# EAGLE design Lab 3 PCB_schematic_redo (EAGLE 9.1.3)
DRAWING_AUTHOR: Cindy Tzapin
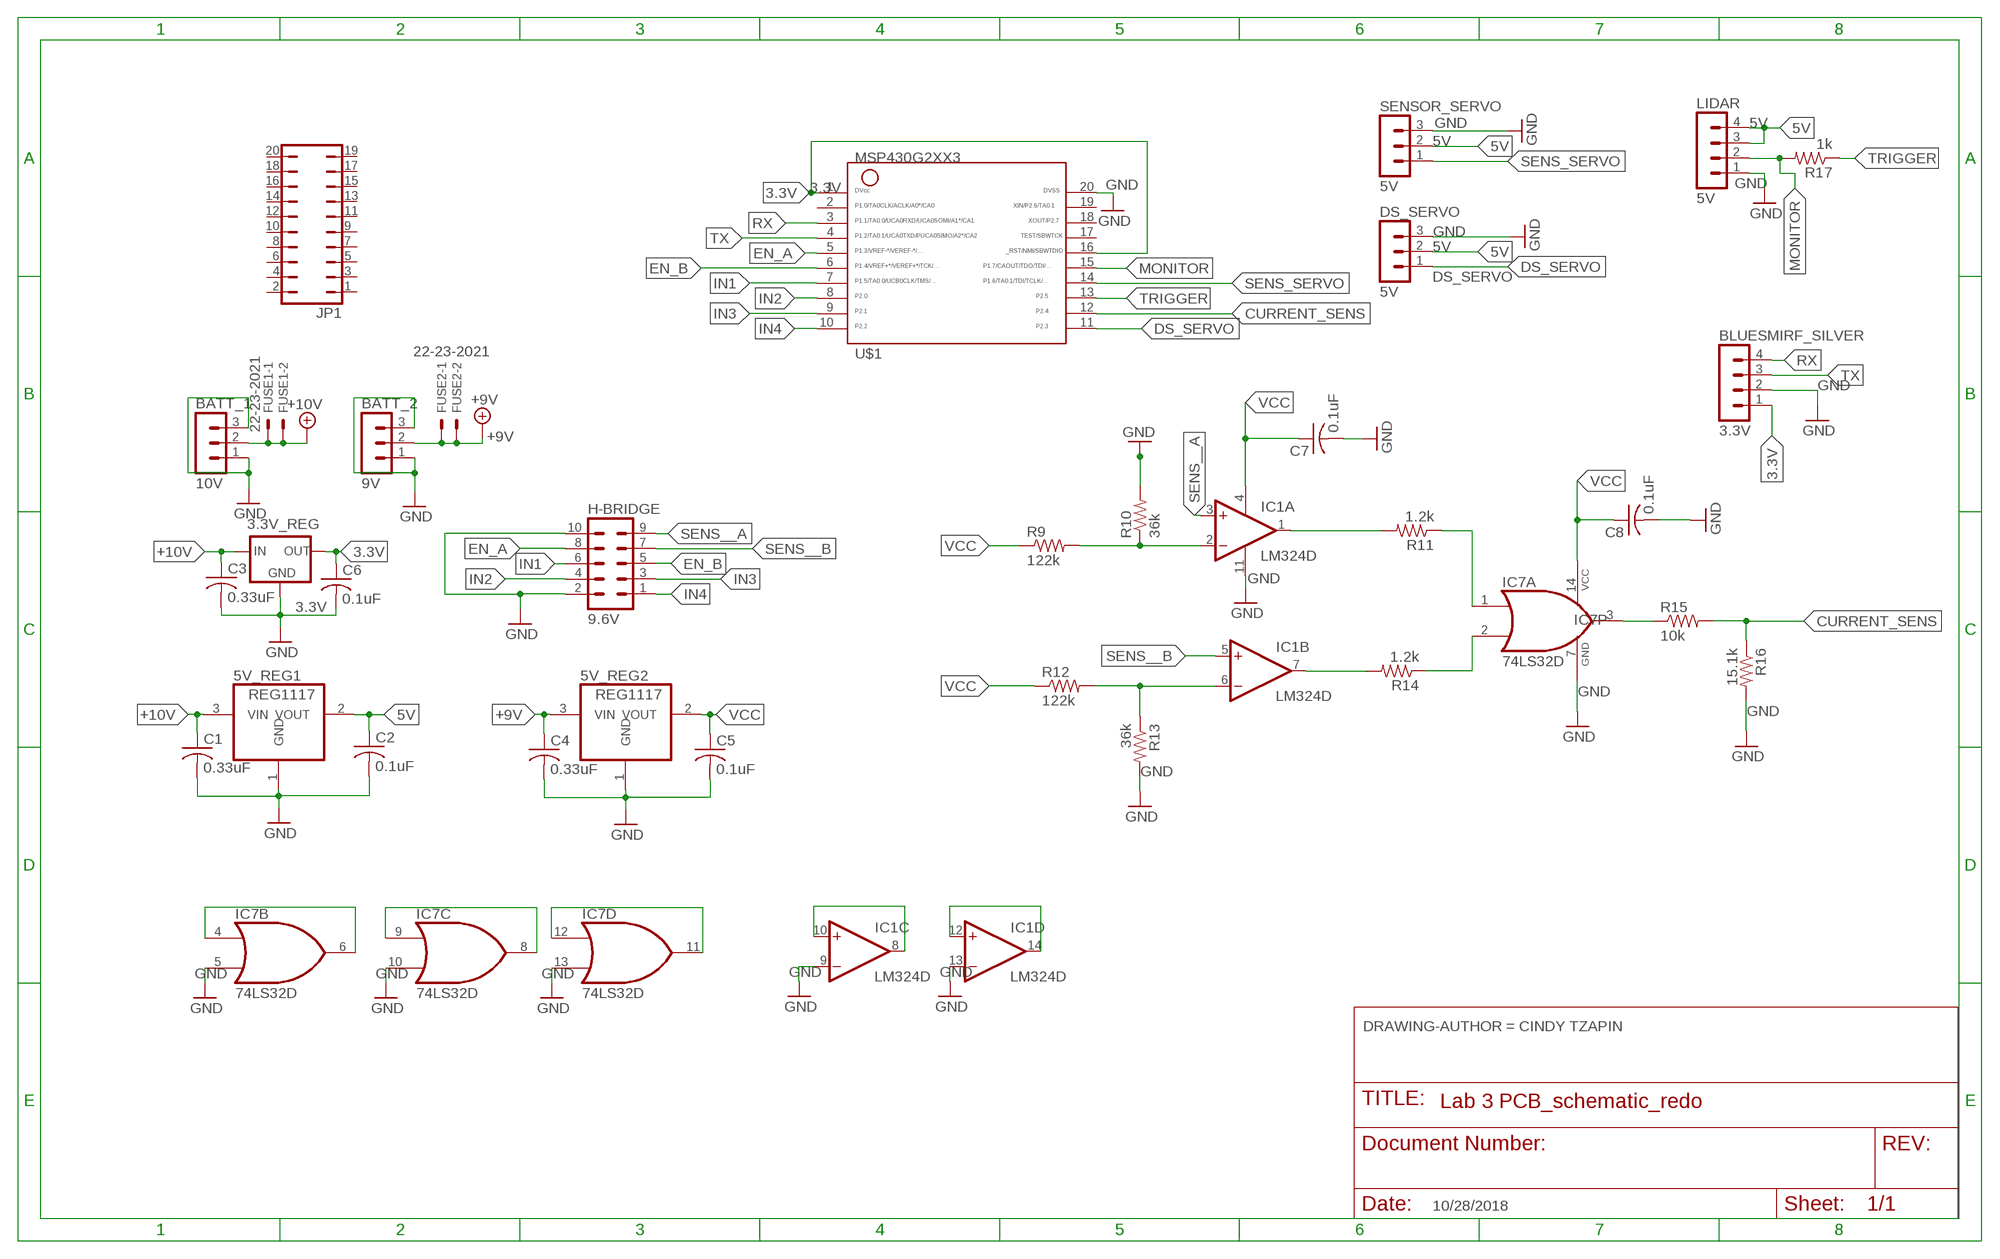
[diagram p0: schematic, sheet 1]
FRAME1 (DOCFIELD): DATE: 10/28/2018; DRAWING-AUTHOR: CINDY TZAPIN

## Parts
3.3V_REG  3.3V  78LXX  [78LXX]
5V_REG1  REG1117  [SOT223]
5V_REG2  REG1117  [SOT223]
BATT_1  10V  MA03-1  [MA03-1]
BATT_2  9V  MA03-1  [MA03-1]
BLUESMIRF_SILVER  3.3V  MA04-1  [MA04-1]
C1  0.33uF  C-US025-024X044  [C025-024X044]
C2  0.1uF  C-US025-024X044  [C025-024X044]
C3  0.33uF  C-US025-024X044  [C025-024X044]
C4  0.33uF  C-US025-024X044  [C025-024X044]
C5  0.1uF  C-US025-024X044  [C025-024X044]
C6  0.1uF  C-US025-024X044  [C025-024X044]
C7  0.1uF  C-US025-024X044  [C025-024X044]
C8  0.1uF  C-US025-024X044  [C025-024X044]
DS_SERVO  5V  MA03-1  [MA03-1]
FUSE1  22-23-2021  [22-23-2021]
FUSE2  22-23-2021  [22-23-2021]
H-BRIDGE  9.6V  MA05-2  [MA05-2]
IC1  LM324D  [SO14]
IC7  74LS32D  [SO14]
JP1  JP10Q  [JP10Q]
LIDAR  5V  MA04-1  [MA04-1]
R9  122k  R-US_R0805  [R0805]
R10  36k  R-US_R0805  [R0805]
R11  1.2k  R-US_R0805  [R0805]
R12  122k  R-US_R0805  [R0805]
R13  36k  R-US_R0805  [R0805]
R14  1.2k  R-US_R0805  [R0805]
R15  10k  R-US_R0805  [R0805]
R16  15.1k  R-US_R0805  [R0805]
R17  1k  R-US_R0805  [R0805]
SENSOR_SERVO  5V  MA03-1  [MA03-1]
U$1  G2XX3---N20  [N20]

## Nets
3.3V: 3.3V_REG.OUT BLUESMIRF_SILVER.1 C6.1 U$1.1 U$1.16
5V: 5V_REG1.2(VOUT) C2.1 DS_SERVO.2 LIDAR.3 LIDAR.4 SENSOR_SERVO.2
+9V: 5V_REG2.3(VIN) BATT_2.2 C4.1 FUSE2.1 FUSE2.2
+10V: 3.3V_REG.IN 5V_REG1.3(VIN) BATT_1.2 C1.1 C3.1 FUSE1.1 FUSE1.2
CURRENT_SENS: R15.2 R16.1 U$1.12
DS_SERVO: DS_SERVO.1 U$1.11
EN_A: H-BRIDGE.8 U$1.5
EN_B: H-BRIDGE.5 U$1.6
GND: 3.3V_REG.GND 5V_REG1.1(GND) 5V_REG2.1(GND) BATT_1.1 BATT_1.3 BATT_2.1 BATT_2.3 BLUESMIRF_SILVER.2 C1.2 C2.2 C3.2 C4.2 C5.2 C6.2 C7.2 C8.2 DS_SERVO.3 H-BRIDGE.2 H-BRIDGE.10 IC1.9(C:-IN) IC1.11(P:V-) IC1.13(D:-IN) IC7.5(B:I1) IC7.7(P:GND) IC7.10(C:I1) IC7.13(D:I1) LIDAR.1 R10.2 R13.2 R16.2 SENSOR_SERVO.3 U$1.20
IN1: H-BRIDGE.6 U$1.7
IN2: H-BRIDGE.4 U$1.8
IN3: H-BRIDGE.3 U$1.9
IN4: H-BRIDGE.1 U$1.10
MONITOR: LIDAR.2 R17.2 U$1.15
N$3: IC7.4(B:I0) IC7.6(B:O)
N$5: IC1.6(B:-IN) R12.2 R13.1
N$7: IC1.2(A:-IN) R9.2 R10.1
N$17: IC7.1(A:I0) R11.1
N$18: IC1.8(C:OUT) IC1.10(C:+IN)
N$19: IC1.1(A:OUT) R11.2
N$20: IC1.7(B:OUT) R14.2
N$21: IC7.2(A:I1) R14.1
N$22: IC7.3(A:O) R15.1
N$28: IC7.8(C:O) IC7.9(C:I0)
N$29: IC7.11(D:O) IC7.12(D:I0)
N$33: IC1.12(D:+IN) IC1.14(D:OUT)
RX: BLUESMIRF_SILVER.4 U$1.3
SENS__A: H-BRIDGE.9 IC1.3(A:+IN)
SENS__B: H-BRIDGE.7 IC1.5(B:+IN)
SENS_SERVO: SENSOR_SERVO.1 U$1.14
TRIGGER: R17.1 U$1.13
TX: BLUESMIRF_SILVER.3 U$1.4
VCC: 5V_REG2.2(VOUT) C5.1 C7.1 C8.1 IC1.4(P:V+) IC7.14(P:VCC) R9.1 R12.1
Unconnected: JP1.1 JP1.2 JP1.3 JP1.4 JP1.5 JP1.6 JP1.7 JP1.8 JP1.9 JP1.10 JP1.11 JP1.12 JP1.13 JP1.14 JP1.15 JP1.16 JP1.17 JP1.18 JP1.19 JP1.20 U$1.2 U$1.17 U$1.18 U$1.19

## Library data of the parts
3.3V_REG = v-reg:78LXX: VOLTAGE REGULATOR; OC_NEWARK: unknown
5V_REG1 5V_REG2 = burr-brown:REG1117: 800mA and 1A Low Dropout (LDO) Positive Regulator 1.8V, 2.5V, 2.85V, 3.3V, 5V, and Adj; OC_FARNELL: 1097566; OC_NEWARK: unknown; SPICEPREFIX: J
BATT_1 BATT_2 DS_SERVO SENSOR_SERVO = con-lstb:MA03-1: PIN HEADER; OC_FARNELL: unknown; OC_NEWARK: unknown
BLUESMIRF_SILVER LIDAR = con-lstb:MA04-1: PIN HEADER; OC_FARNELL: unknown; OC_NEWARK: unknown
C1-C8 = resistor:C-US: CAPACITOR, American symbol
FUSE1 FUSE2 = con-molex:22-23-2021: .100" (2.54mm) Center Header - 2 Pin; MF: MOLEX; MPN: 22-23-2021; OC_FARNELL: 1462926; OC_NEWARK: 25C3832
H-BRIDGE = con-lstb:MA05-2: PIN HEADER; OC_FARNELL: unknown; OC_NEWARK: unknown
IC1 = linear:LM324: OP AMP; OC_NEWARK: unknown
IC7 = 74xx-us:74*32: Quad 2-input OR gate; OC_NEWARK: unknown
JP1 = jumper:JP10Q: JUMPER
R9-R17 = rcl:R-US_: RESISTOR, American symbol; OC_NEWARK: unknown; SPICEPREFIX: R
U$1 = TI_MSP430_v16:G2XX3---N20: MSP430G2XX1 PDIP (N) 20 Pin Package; OC_NEWARK: unknown

## Net classes
0 default: width 0.559 mm, drill 0.508 mm, clearance 0.254 mm

## Board
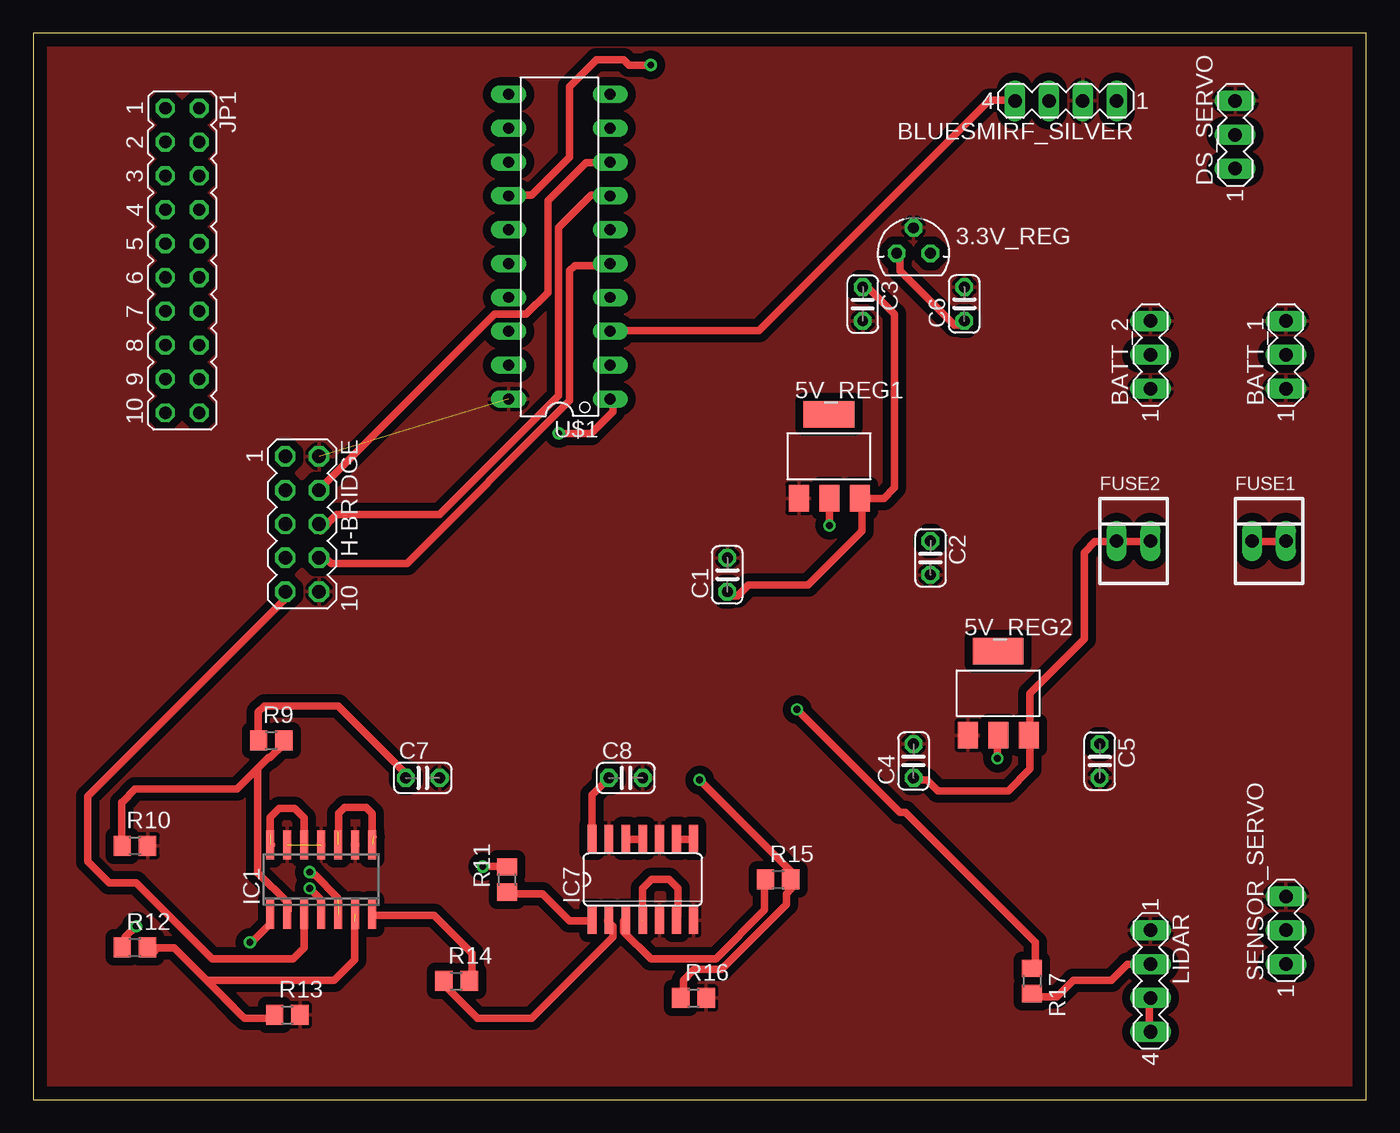
[diagram p1: board, top side]
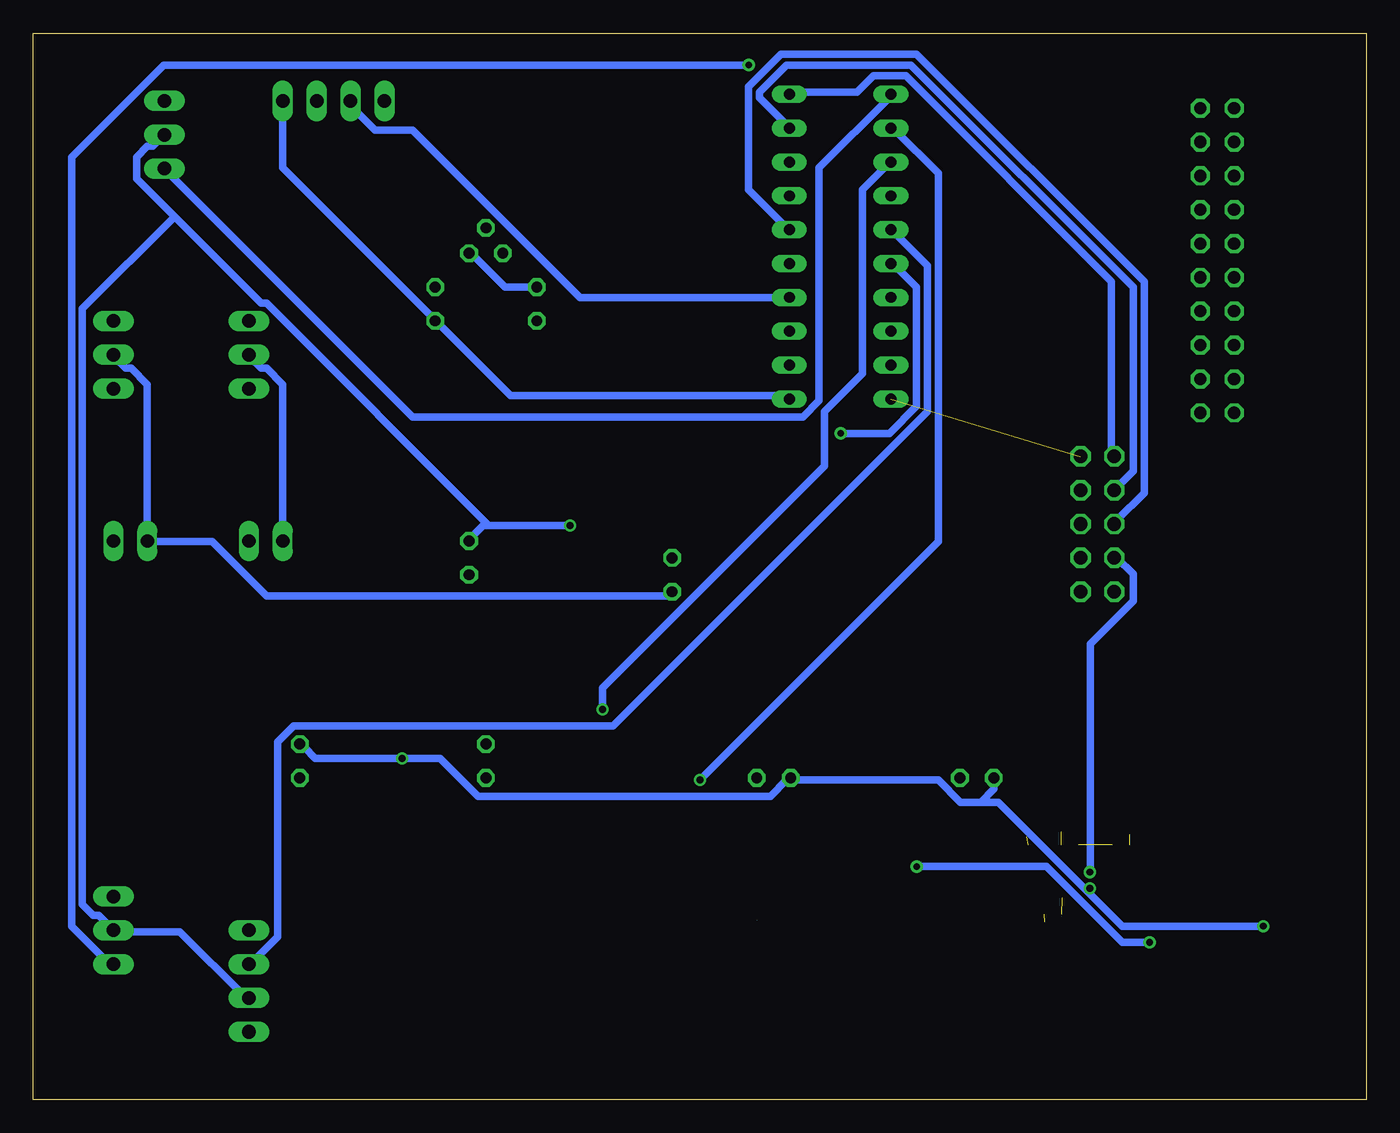
[diagram p2: board, bottom side, seen from below]

Size 100 x 80 mm. Coordinates in mm from the lower left corner, seen from the top.
Outline: 0,0 100,0 100,80 0,80 0,0
Copper layers (1*16): Top 0.035mm / dielectric 1.5mm / Bottom 0.035mm
Design rules "default *": minimum track width 10mil, minimum drill 0.35mm, track to track 10mil, track to pad 6mil, pad to pad 10mil, via to via 6mil, smd to smd 6mil, copper to edge 40mil, drill to drill 10mil, minimum pad ring 10mil, minimum via ring 8mil, stop-mask expansion 4mil, vias tented up to drill 0mil, thermal gap 10mil

### Footprints (pad centres in the part's own frame; a part is rotated, then mirrored left to right if it is on the bottom)
78LXX = drill 0.813 octagon: GND 0,1.905; IN 1.27,0; OUT -1.27,0
SOT223 = smd 1.499 x 2.007: 1 -2.261,-3.15; 2 0.025,-3.15; 3 2.311,-3.15 | smd 3.81 x 2.007: 4 0,3.15
MA03-1 = drill 1.016 long: 1 -2.54,0; 2 0,0; 3 2.54,0
MA04-1 = drill 1.016 long: 1 -3.81,0; 2 -1.27,0; 3 1.27,0; 4 3.81,0
C025-024X044 = drill 0.813 octagon: 1 -1.27,0; 2 1.27,0
22-23-2021 = drill 1 long: 1 -1.27,0; 2 1.27,0
MA05-2 = drill 1.016 octagon: 1 -5.08,-1.27; 2 -5.08,1.27; 3 -2.54,-1.27; 4 -2.54,1.27; 5 0,-1.27; 6 0,1.27; 7 2.54,-1.27; 8 2.54,1.27; 9 5.08,-1.27; 10 5.08,1.27
SO14 = smd 0.6 x 2.2: 1 -3.81,-2.6; 2 -2.54,-2.6; 3 -1.27,-2.6; 4 0,-2.6; 5 1.27,-2.6; 6 2.54,-2.6; 7 3.81,-2.6; 8 3.81,2.6; 9 2.54,2.6; 10 1.27,2.6; 11 0,2.6; 12 -1.27,2.6; 13 -2.54,2.6; 14 -3.81,2.6
SO14' = smd 0.66 x 2.032: 1 -3.81,-3.073; 2 -2.54,-3.073; 3 -1.27,-3.073; 4 0,-3.073; 5 1.27,-3.073; 6 2.54,-3.073; 7 3.81,-3.073; 8 3.81,3.073; 9 2.54,3.073; 10 1.27,3.073; 11 0,3.073; 12 -1.27,3.073; 13 -2.54,3.073; 14 -3.81,3.073
JP10Q = drill 0.914 octagon: 1 -11.43,-1.27; 2 -11.43,1.27; 3 -8.89,-1.27; 4 -8.89,1.27; 5 -6.35,-1.27; 6 -6.35,1.27; 7 -3.81,-1.27; 8 -3.81,1.27; 9 -1.27,-1.27; 10 -1.27,1.27; 11 1.27,-1.27; 12 1.27,1.27; 13 3.81,-1.27; 14 3.81,1.27; 15 6.35,-1.27; 16 6.35,1.27; 17 8.89,-1.27; 18 8.89,1.27; 19 11.43,-1.27; 20 11.43,1.27
R0805 = smd 1.3 x 1.5: 1 -0.95,0; 2 0.95,0
N20 = drill 0.813 long: 1 -11.435,-3.81; 2 -8.895,-3.81; 3 -6.355,-3.81; 4 -3.815,-3.81; 5 -1.275,-3.81; 6 1.265,-3.81; 7 3.805,-3.81; 8 6.345,-3.81; 9 8.885,-3.81; 10 11.425,-3.81; 11 11.425,3.81; 12 8.885,3.81; 13 6.345,3.81; 14 3.805,3.81; 15 1.265,3.81; 16 -1.275,3.81; 17 -3.815,3.81; 18 -6.355,3.81; 19 -8.895,3.81; 20 -11.435,3.81

### Placement (x,y rotation side)
3.3V_REG  66.04,63.5 0 top
5V_REG1  59.69,48.26 0 top
5V_REG2  72.39,30.48 0 top
BATT_1  93.98,55.88 90 top
BATT_2  83.82,55.88 90 top
BLUESMIRF_SILVER  77.47,74.93 180 top
C1  52.07,39.37 90 top
C2  67.31,40.64 270 top
C3  62.23,59.69 270 top
C4  66.04,25.4 90 top
C5  80.01,25.4 270 top
C6  69.85,59.69 90 top
C7  29.21,24.13 0 top
C8  44.45,24.13 0 top
DS_SERVO  90.17,72.39 90 top
FUSE1  92.71,41.91 0 top
FUSE2  82.55,41.91 0 top
H-BRIDGE  20.17,43.18 270 top
IC1  21.59,16.51 0 top
IC7  74LS32D  [SO14']  45.72,16.51 0 top
JP1  11.18,62.96 270 top
LIDAR  83.82,8.89 270 top
R9  17.86,26.95 0 top
R10  7.62,19.05 0 top
R11  35.56,16.51 90 top
R12  7.62,11.43 0 top
R13  19.05,6.35 0 top
R14  31.75,8.89 0 top
R15  55.88,16.51 0 top
R16  49.53,7.62 0 top
R17  74.93,8.89 270 top
SENSOR_SERVO  93.98,12.7 90 top
U$1  39.47,64 90 top

### Tracks (layer width: path | path; a pad name or v marks a point on that pad's centre or on a via)
3.3V  (via drill 0.51)
  Top 0.559: v39.42,49.99 41.86,49.99 43.48,51.61 43.48,52.43 U$1.1 | 3.3V_REG.OUT 65.02,63.4 65.02,62.18 69.09,58.12 69.49,58.12 C6.1
  Bottom 0.559: U$1.1 43.48,52.83 64.21,52.83 69.49,58.12 C6.1 69.9,58.52 81.28,69.9 BLUESMIRF_SILVER.1 | v39.42,49.99 35.76,49.99 33.73,52.02 33.73,60.96 35.36,62.59 U$1.16
5V  (via drill 0.51)
  Top 0.559: LIDAR.4 83.72,5.28 83.72,7.32 LIDAR.3 | v59.74,43.08 59.74,45.11 5V_REG1.2
  Bottom 0.559: LIDAR.3 84.12,7.72 89,12.6 93.88,12.6 SENSOR_SERVO.2 95.1,13.82 95.5,13.82 96.32,14.63 96.32,59.33 89.41,66.24 | 65.84,43.08 66.24,43.08 67.06,42.27 C2.1 | 65.84,43.08 v59.74,43.08 | DS_SERVO.2 91.03,71.53 91.44,71.53 92.25,70.71 92.25,69.09 89.41,66.24 | 89.41,66.24 82.91,59.74 82.5,59.74 65.84,43.08
+9V
  Top 0.559: C4.1 66.24,23.98 67.06,23.98 67.87,23.16 73.15,23.16 74.78,24.79 74.78,27.23 5V_REG2.3 74.78,27.64 74.78,30.48 78.84,34.54 78.84,41.05 79.65,41.86 81.28,41.86 | 81.28,41.86 83.72,41.86 FUSE2.2 | 81.28,41.86 FUSE2.1
  Bottom 0.559: FUSE2.1 81.28,53.65 82.5,54.86 82.91,54.86 83.72,55.68 BATT_2.2
+10V
  Top 0.559: FUSE1.1 91.44,41.86 93.88,41.86 FUSE1.2 | 62.18,45.11 62.18,42.67 58.12,38.61 53.65,38.61 52.83,37.8 52.43,37.8 C1.1 | 62.18,45.11 63.8,45.11 64.62,45.92 64.62,58.93 62.59,60.96 C3.1 | 62.18,45.11 5V_REG1.3
  Bottom 0.559: BATT_1.2 93.88,55.68 93.07,54.86 92.66,54.86 91.44,53.65 FUSE1.1 91.44,41.86 86.56,41.86 82.5,37.8 52.43,37.8 C1.1 | C3.1 64.62,60.96 67.06,63.4 3.3V_REG.IN
CURRENT_SENS  (via drill 0.51)
  Top 0.559: R16.1 48.77,7.72 48.77,8.94 49.58,9.75 51.61,9.75 56.49,14.63 56.49,15.44 56.9,15.85 56.9,16.26 R15.2 56.9,16.66 56.9,17.07 v49.99,23.98
  Bottom 0.559: v49.99,23.98 32.11,41.86 32.11,69.49 35.36,72.75 U$1.12
DS_SERVO
  Bottom 0.559: DS_SERVO.1 71.53,51.21 42.27,51.21 41.05,52.43 41.05,69.9 35.76,75.18 U$1.11
EN_A
  Top 0.559: U$1.5 43.08,62.59 40.64,62.59 40.23,62.18 40.23,52.43 28.04,40.23 22.35,40.23 21.54,41.05 H-BRIDGE.8
EN_B
  Bottom 0.559: U$1.6 43.48,65.43 46.33,68.28 46.33,76 43.89,78.44 33.73,78.44 16.66,61.37 16.66,45.52 18.69,43.48 H-BRIDGE.5
GND  (2 unrouted)
  pour Top (isolate 0.61): -1.27,81.28 -1.27,-1.27 101.6,-1.27 101.6,81.28
IN1
  Top 0.559: U$1.7 43.08,67.87 41.86,67.87 39.42,65.43 39.42,52.83 30.48,43.89 22.76,43.89 21.54,42.67 21.13,43.08 H-BRIDGE.6
IN2
  Top 0.559: U$1.8 43.08,70.31 41.45,70.31 38.61,67.46 38.61,60.55 36.98,58.93 34.61,58.93 21.61,45.92 21.54,45.92 H-BRIDGE.4
IN3
  Bottom 0.559: U$1.9 43.48,73.15 45.52,75.18 45.52,75.59 43.48,77.62 34.14,77.62 17.48,60.96 17.48,47.14 18.69,45.92 H-BRIDGE.3
IN4
  Bottom 0.559: U$1.10 43.08,75.59 38.2,75.59 36.98,76.81 34.54,76.81 19.1,61.37 19.1,48.36 H-BRIDGE.1
MONITOR
  Top 0.559: LIDAR.2 82.09,10.16 80.87,8.94 78.03,8.94 76.81,7.72 75.18,7.72 R17.2
  Bottom 0.559: U$1.15 35.36,65.02 32.92,62.59 32.92,51.61 56.49,28.04 80.47,28.04 81.69,26.82 81.69,12.19 83.72,10.16 LIDAR.2
N$3  (1 unrouted)
  Top 0.559: IC7.6 48.36,13.82 48.36,15.84 47.68,16.52 46.39,16.52 45.72,15.85 IC7.4
N$5  (1 unrouted)
  Top 0.559: 15.57,6.38 13.01,8.94 22.57,8.94 24.09,10.46 24.09,13.35 | R13.1 17.88,6.1 15.85,6.1 15.57,6.38 | R12.2 8.53,11.38 8.53,10.97 8.94,10.97 9.35,11.38 10.57,11.38 14.63,7.32 15.57,6.38 | 24.16,13.9 IC1.6
N$7
  Top 0.559: 16.82,24.82 16.82,17.02 19.1,14.74 19.1,14.22 IC1.2 | 18.78,26.95 R9.2 18.81,26.7 17.78,25.67 17.67,25.67 16.82,24.82 | R10.1 6.62,19.09 6.62,22.31 6.67,22.31 7.66,23.3 15.29,23.3 16.47,24.47 16.82,24.82
N$17
  Top 0.559: R11.1 35.76,15.44 38.2,15.44 40.23,13.41 41.86,13.41 IC7.1
N$18  (2 unrouted)
  Top 0.559: 25.48,19.71 25.43,19.76 25.43,21.45 24.98,21.9 23.34,21.9 22.89,21.45 22.89,20.08 22.88,20.07
N$19  (via drill 0.51)
  Top 0.559: v33.73,17.48 35.36,17.48 R11.2 | IC1.1 17.78,13.19 16.37,11.79 v16.26,11.79
  Bottom 0.559: v33.73,17.48 23.98,17.48 18.29,11.79 v16.26,11.79
N$20
  Top 0.559: R14.2 32.92,8.94 32.92,10.97 30.07,13.82 25.6,13.82 IC1.7
N$21
  Top 0.559: R14.1 30.89,8.53 33.33,6.1 37.39,6.1 43.48,12.19 43.48,13.01 43.08,13.41 IC7.2
N$22
  Top 0.559: R15.1 54.86,16.26 54.86,14.22 51.21,10.57 46.33,10.57 44.3,12.6 44.3,13.41 IC7.3
N$28
  Top 0.559: IC7.9 48.36,19.51 49.58,19.51 IC7.8
N$29
  Top 0.559: IC7.12 44.7,19.51 45.52,19.51 IC7.11
N$33  (1 unrouted)
  Top 0.559: IC1.12 20.32,21.13 19.6,21.86 18.45,21.86 17.77,21.17 17.77,19.89 17.78,19.89 | 17.88,19.1 IC1.14
RX
  Top 0.559: U$1.3 43.48,57.71 54.46,57.71 70.86,74.11 71.12,74.37 71.74,74.99 73.6,74.99 BLUESMIRF_SILVER.4
SENS__A
  Top 0.559: 20.32,13.01 IC1.3 20.32,11.38 19.51,10.57 13.41,10.57 7.72,16.26 5.69,16.26 4.06,17.88 4.06,22.76 19.1,37.8 H-BRIDGE.9
SENS__B  (via drill 0.51)  (1 unrouted)
  Top 0.559: v20.73,17.07 20.95,16.84 21.14,16.84 22.84,15.14
  Bottom 0.559: H-BRIDGE.7 18.69,40.64 17.48,39.42 17.48,37.39 20.68,34.18 20.68,17.11 v20.73,17.07
SENS_SERVO  (via drill 0.51)
  Top 0.559: v46.33,77.62 44.7,77.62 44.3,78.03 42.27,78.03 40.23,76 40.23,70.71 37.39,67.87 35.76,67.87 U$1.14
  Bottom 0.559: v46.33,77.62 90.22,77.62 97.13,70.71 97.13,13.01 94.28,10.16 SENSOR_SERVO.1
TRIGGER  (via drill 0.51)
  Top 0.559: v57.3,29.26 65.02,21.54 65.43,21.54 75.18,11.79 75.18,10.16 R17.1
  Bottom 0.559: v57.3,29.26 57.3,30.89 40.64,47.55 40.64,51.61 37.8,54.46 37.8,68.28 35.76,70.31 U$1.13
TX
  Bottom 0.559: BLUESMIRF_SILVER.3 76.4,74.78 74.37,72.75 71.53,72.75 58.96,60.18 U$1.4
VCC  (via drill 0.51)
  Top 0.559: v72.34,25.6 72.34,27.23 5V_REG2.2 | 41.86,19.51 IC7.14 41.91,22.86 C8.1 | v7.72,13.01 6.91,12.19 6.91,11.79 R12.1 | R9.1 16.89,26.98 16.89,29.08 17.34,29.53 22.89,29.53 27.94,24.48 C7.1 | v20.73,15.85 21.54,15.04 21.54,14.22 IC1.4
  Bottom 0.559: C5.1 79.65,26.42 78.84,25.6 v72.34,25.6 69.49,25.6 66.65,22.76 44.7,22.76 43.48,23.98 43.33,23.98 C8.1 43.03,23.98 32.11,23.98 30.43,22.31 28.93,22.31 | v7.72,13.01 18.29,13.01 21.13,15.85 | 21.13,15.85 27.59,22.31 28.93,22.31 | 27.81,24.07 C7.1 27.94,23.29 28.93,22.31 | 21.13,15.85 v20.73,15.85